# EAGLE design OP LILYGO PT2 (EAGLE 7.1.0)

## Sheet 1 of 2
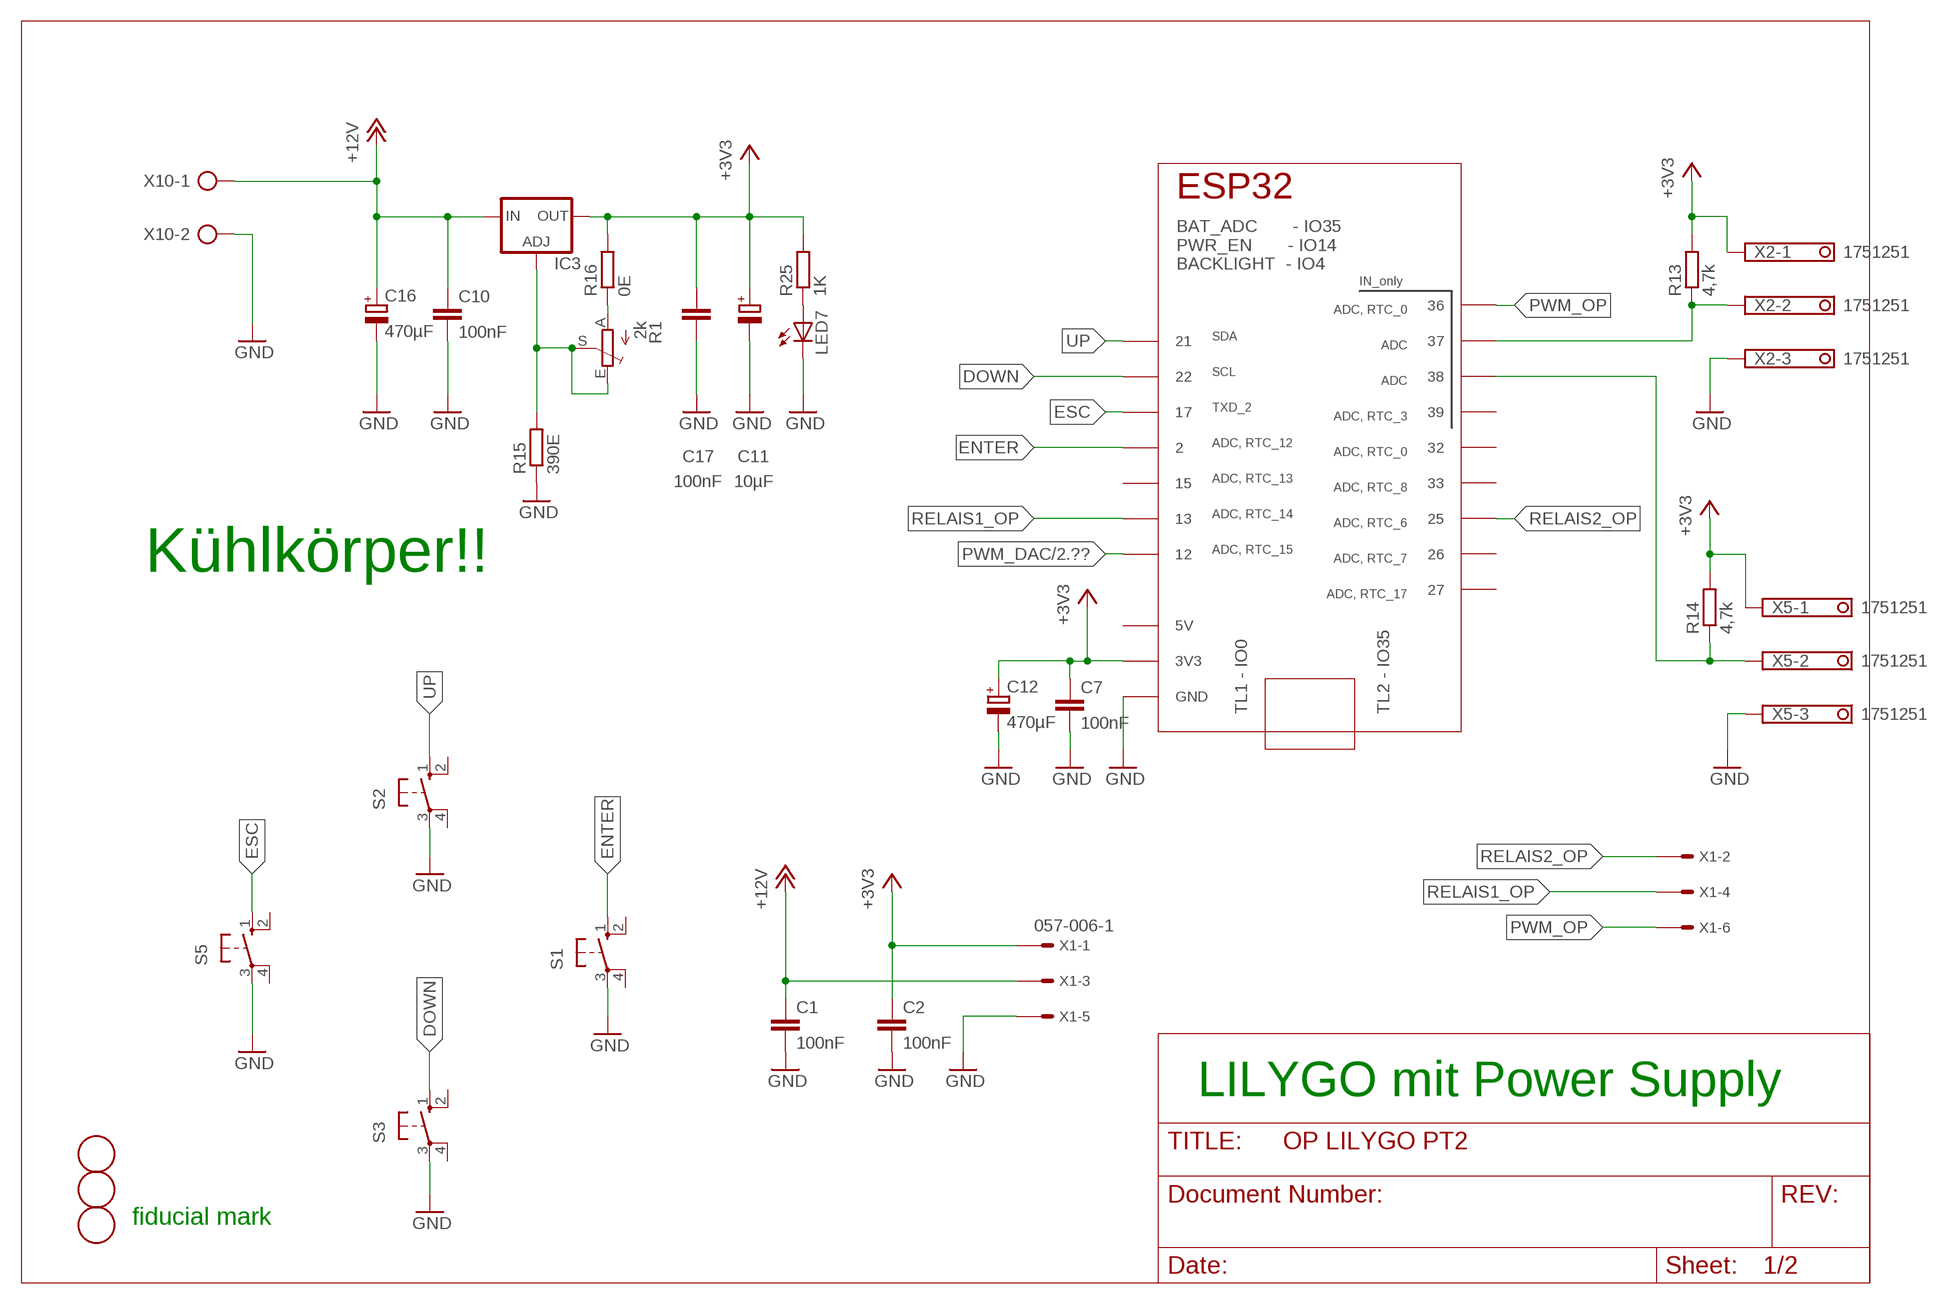
[diagram p0: schematic, sheet 1]

### Parts
C1  100nF  C-EU025-030X050  [C025-030X050]
C2  100nF  C-EU025-030X050  [C025-030X050]
C7  100nF  C-EU025-030X050  [C025-030X050]
C10  100nF  C-EU025-030X050  [C025-030X050]
C11  10µF  CPOL-EUE2.5-6  [E2,5-6]
C12  470µF  CPOL-EUE2.5-6  [E2,5-6]
C16  470µF  CPOL-EUE2.5-6  [E2,5-6]
C17  100nF  C-EU025-030X050  [C025-030X050]
IC3  LM317TS  [317TS]
IC4  TTGO_DISP  [TTGO_DISP_DEFAULT]
LED7  LED5MM  [LED5MM]
R1  2k  TRIM_1234-S64YW  [S64YW]
R13  4,7k  R-EU_0207/12  [0207/12]
R14  4,7k  R-EU_0207/12  [0207/12]
R15  390E  R-EU_0207/12  [0207/12]
R16  0E  R-EU_0207/12  [0207/12]
R25  1K  R-EU_0207/12  [0207/12]
S1  10-XX  [B3F-10XX]
S2  10-XX  [B3F-10XX]
S3  10-XX  [B3F-10XX]
S5  10-XX  [B3F-10XX]
U$2  FIDUCIALMOUNT  [FIDUCIA-MOUNT]
U$7  FIDUCIALMOUNT  [FIDUCIA-MOUNT]
U$8  FIDUCIALMOUNT  [FIDUCIA-MOUNT]
X1  057-006-1  [057-006-1]
X2  1751251  [1751251]
X5  1751251  [1751251]
X10  SMKDSP_1,5/2  [SMKDSP_1,5/2]

### Nets
+3V3: C2.1 C7.1 C11.+ C12.+ C17.1 IC3.2(OUT) IC4.3V3_1(3V3) IC4.3V3_2(3V3) R13.2 R14.2 R16.2 R25.2 X1.1 X2.1 X5.1
+12V: C1.1 C10.1 C16.+ IC3.3(IN) X1.3 X10.1 ; also sheet 2
DOWN: IC4.22 S3.1(S)
ENTER: IC4.2 S1.1(S)
ESC: IC4.17 S5.1(S)
GND: C1.2 C2.2 C7.2 C10.2 C11.- C12.- C16.- C17.2 IC4.GND_1(GND) IC4.GND_2(GND) IC4.GND_3(GND) IC4.GND_4(GND) IC4.GND_5(GND) LED7.K(C) R15.1 S1.3(P) S2.3(P) S3.3(P) S5.3(P) X1.5 X2.3 X5.3 X10.2 ; also sheet 2
N$1: IC3.1(ADJ) R1.E R1.S R15.2
N$2: R1.A R16.1
N$15: IC4.37 R13.1 X2.2
N$19: IC4.38 R14.1 X5.2
N$38: LED7.A R25.1
PWM_DAC: IC4.12 ; also sheet 2
PWM_OP: IC4.36 X1.6
RELAIS1_OP: IC4.13 X1.4
RELAIS2_OP: IC4.25 X1.2
UP: IC4.21 S2.1(S)
Unconnected: IC4.5V IC4.15 IC4.26 IC4.27 IC4.32 IC4.33 IC4.39 R1.S@1(S) S1.2(S1) S1.4(P1) S2.2(S1) S2.4(P1) S3.2(S1) S3.4(P1) S5.2(S1) S5.4(P1)

### Notes on the sheet
- Kühlkörper!!
- LILYGO mit Power Supply
- fiducial mark

## Sheet 2 of 2
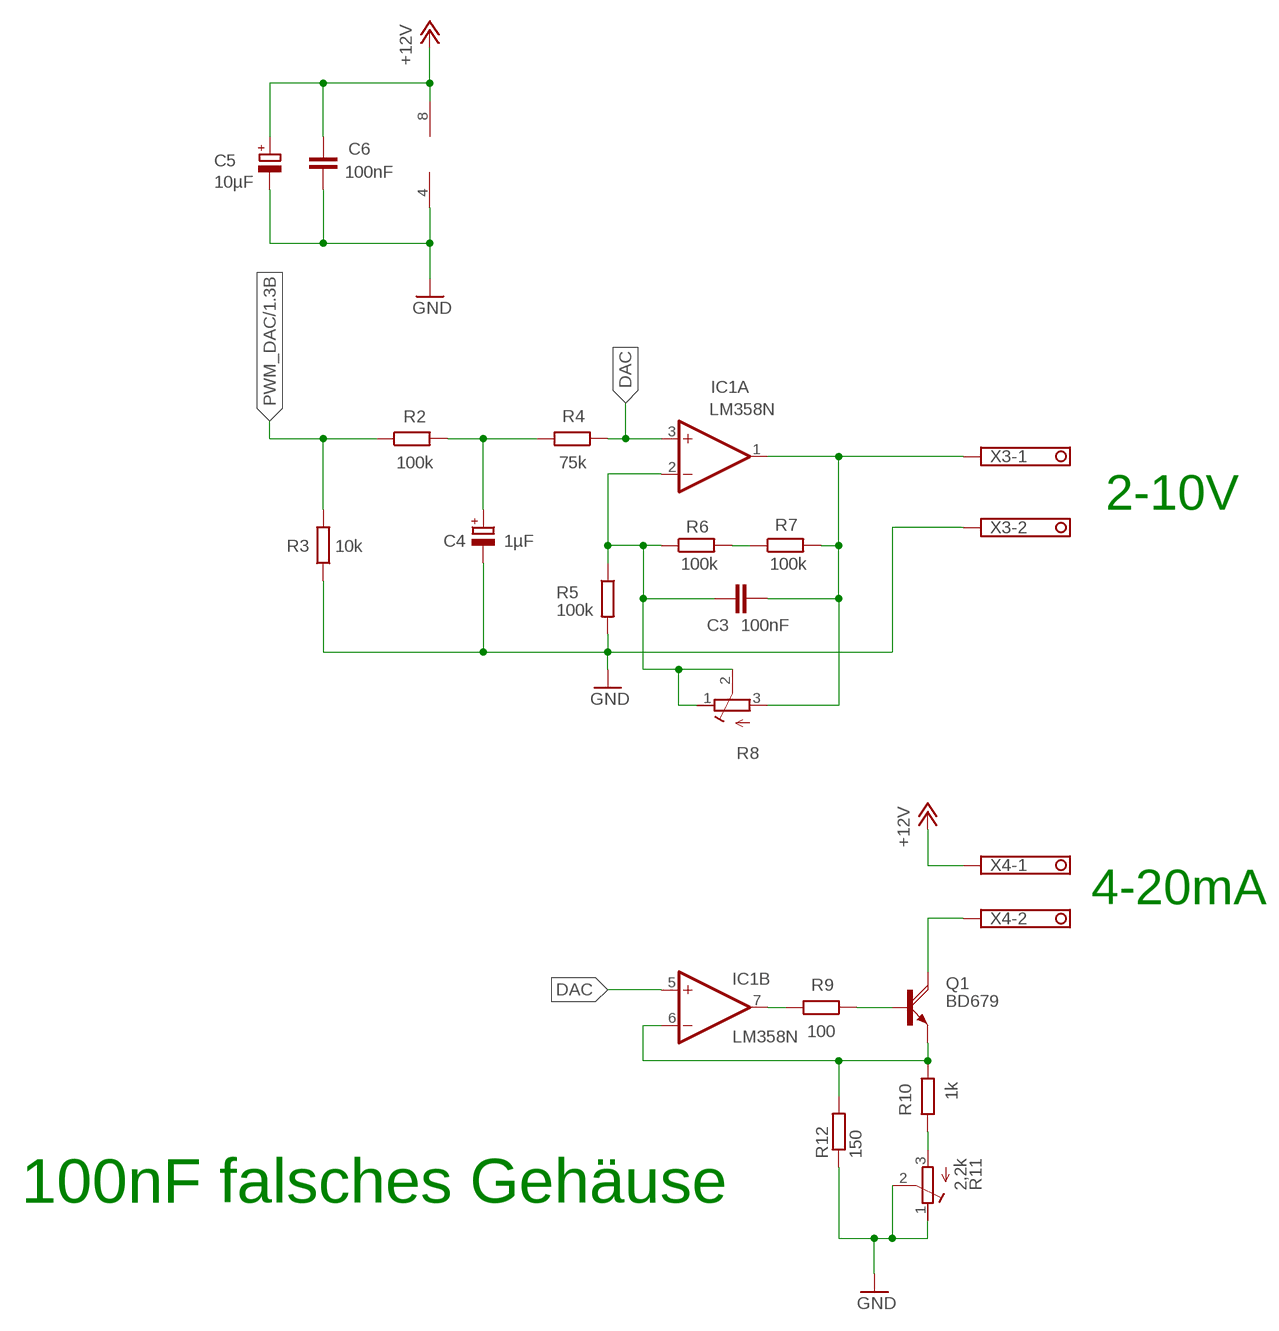
[diagram p1: schematic, sheet 2]

### Parts
C3  100nF  C-EU050-035X075  [C050-035X075]
C4  1µF  CPOL-EUE2.5-5  [E2,5-5]
C5  10µF  CPOL-EUE2.5-5  [E2,5-5]
C6  100nF  C-EU050-035X075  [C050-035X075]
IC1  LM358N  [DIL08]
Q1  BD679  [TO126AV]
R2  100k  R-EU_0207/2V  [0207/2V]
R3  10k  R-EU_0207/2V  [0207/2V]
R4  75k  R-EU_0207/2V  [0207/2V]
R5  100k  R-EU_0207/2V  [0207/2V]
R6  100k  R-EU_0207/2V  [0207/2V]
R7  100k  R-EU_0207/2V  [0207/2V]
R8  R-TRIMMT93YA  [RTRIMT93YA]
R9  100  R-EU_0207/10  [0207/10]
R10  1k  R-EU_0207/2V  [0207/2V]
R11  2,2k  R-TRIMMT93YA  [RTRIMT93YA]
R12  150  R-EU_0207/12  [0207/12]
X3  1751248  [1751248]
X4  1751248  [1751248]

### Nets
+12V: C5.+ C6.1 IC1.8(P:V+) X4.1 ; also sheet 1
DAC: IC1.3(A:+IN) IC1.5(B:+IN) R4.1
GND: C4.- C5.- C6.2 IC1.4(P:V-) R3.1 R5.2 R11.1(E) R11.2(S) R12.1 X3.2 ; also sheet 1
N$12: C3.1 IC1.2(A:-IN) R5.1 R6.1 R8.1(E) R8.2(S)
N$13: C4.+ R2.2 R4.2
N$14: R10.2 R11.3(A)
N$16: C3.2 IC1.1(A:OUT) R7.2 R8.3(A) X3.1
N$17: R6.2 R7.1
N$18: IC1.6(B:-IN) Q1.E R10.1 R12.2
N$20: Q1.B R9.1
N$21: IC1.7(B:OUT) R9.2
N$22: Q1.C X4.2
PWM_DAC: R2.1 R3.2 ; also sheet 1

### Notes on the sheet
- 2-10V
- 4-20mA
- 100nF falsches Gehäuse

## Library data of the parts
C1-C3 C6 C7 C10 C17 = rcl:C-EU: CAPACITOR, European symbol
C4 C5 C11 C12 C16 = rcl:CPOL-EU: POLARIZED CAPACITOR, European symbol
IC1 = linear:LM358: OP AMP also LM158; LM258; LM2904 Source: http://cache.national.com/ds/LM/LM158.pdf
IC3 = v-reg:LM317TS: VOLTAGE REGULATOR
IC4 = TTGO_LCD_DISP:TTGO_DISP; HEIGHT: 11
LED7 = led:LED: LED OSRAM: - CHIPLED LG R971, LG N971, LY N971, LG Q971, LY Q971, LO R971, LY R971 LH N974, LH R974 LS Q976, LO Q976, LY Q976 LO Q996 - Hyper CHIPLED LW Q18S LB Q993, LB Q99A, LB R99A - SideLED LS A670, LO A670, LY A670, LG A670, LP A670 LB A673, LV A673, LT A673, LW A673 LH A674 LY A675 LS A676, LA A676, LO A676, LY A676, LW A676 LS A679, LY A679, LG A679 - Hyper Micro SIDELED® LS Y876, LA Y876, LO Y876, LY Y876 LT Y87S - SmartLED LW L88C, LW L88S LB L89C, LB L89S, LG L890 LS L89K, LO L89K, LY L89K LS L896, LA L896, LO L896, LY L896 - TOPLED LS T670, LO T670, LY T670, LG T670, LP T670 LSG T670, LSP T670, LSY T670, LOP T670, LYG T670 LG T671, LOG T671, LSG T671 LB T673, LV T673, LT T673, LW T673 LH T674 LS T676, LA T676, LO T676, LY T676, LB T676, LH T676, LSB T676, LW T676 LB T67C, LV T67C, LT T67C, LS T67K, LO T67K, LY T67K, LW E67C LS E67B, LA E67B, LO E67B, LY E67B, LB E67C, LV E67C, LT E67C LW T67C LS T679, LY T679, LG T679 LS T770, LO T770, LY T770, LG T770, LP T770 LB T773, LV T773, LT T773, LW T773 LH T774 LS E675, LA E675, LY E675, LS T675 LS T776, LA T776, LO T776, LY T776, LB T776 LHGB T686 LT T68C, LB T68C - Hyper Mini TOPLED® LB M676 - Mini TOPLED Santana® LG M470 LS M47K, LO M47K, LY M47K Source: http://www.osram.convergy.de LUXEON: - LUMILED® LXK2-PW12-R00, LXK2-PW12-S00, LXK2-PW14-U00, LXK2-PW14-V00 LXK2-PM12-R00, LXK2-PM12-S00, LXK2-PM14-U00 LXK2-PE12-Q00, LXK2-PE12-R00, LXK2-PE12-S00, LXK2-PE14-T00, LXK2-PE14-U00 LXK2-PB12-K00, LXK2-PB12-L00, LXK2-PB12-M00, LXK2-PB14-N00, LXK2-PB14-P00, LXK2-PB14-Q00 LXK2-PR12-L00, LXK2-PR12-M00, LXK2-PR14-Q00, LXK2-PR14-R00 LXK2-PD12-Q00, LXK2-PD12-R00, LXK2-PD12-S00 LXK2-PH12-R00, LXK2-PH12-S00 LXK2-PL12-P00, LXK2-PL12-Q00, LXK2-PL12-R00 Source: www.luxeon.com KINGBRIGHT: KA-3528ASYC Source: www.kingbright.com
Q1 = transistor-power:BD679: NPN DARLINGTON TRANSISTOR
R1 = pot:TRIM_1234-: POTENTIOMETER
R2-R7 R9 R10 R12-R16 R25 = rcl:R-EU_: RESISTOR, European symbol
R8 R11 = rcl:R-TRIMM: Trimm resistor
S1-S3 S5 = switch-omron:10-XX: OMRON SWITCH; MPN: B3F-1000; OC_FARNELL: 176432; OC_NEWARK: 36M3542
U$2 U$7 U$8 = SmartPrj:FIDUCIALMOUNT
X1 = con-panduit:057-006-: CONNECTOR 6-pin series 057 contact pc board low profile headers; OC_FARNELL: unknown; OC_NEWARK: unknown
X2 X5 = con-phoenix-350:1751251: MKDS 1/ 3-3,5 Printklemme Nennstrom: 10 A Bemessungsspannung: 160 V Raster: 3,5 mm Polzahl: 3 Montageart: Löten Anschlussart: Schraubanschluss Anschlussrichtung vom Leiter zur Platine: 0° Source: http://eshop.phoenixcontact.com .. 1751251.pdf; OC_FARNELL: unknown; OC_NEWARK: unknown
X3 X4 = con-phoenix-350:1751248: MKDS 1/ 2-3,5 Printklemme Nennstrom: 10 A Bemessungsspannung: 160 V Raster: 3,5 mm Polzahl: 2 Montageart: Löten Anschlussart: Schraubanschluss Anschlussrichtung vom Leiter zur Platine: 0° Source: http://eshop.phoenixcontact.com .. 1751248.pdf; OC_FARNELL: unknown; OC_NEWARK: unknown
X10 = con-phoenix-smkdsp:SMKDSP_1,5/2: Printklemme, Nennstrom: 17,5 A, Bemessungsspannung: 250 V, Raster: 5,0 mm Source: http://eshop.phoenixcontact.de .. 1733415.pdf; MF: FARNELL; MPN: 1733570; OC_FARNELL: 3041244; OC_NEWARK: 69C8588

## Board
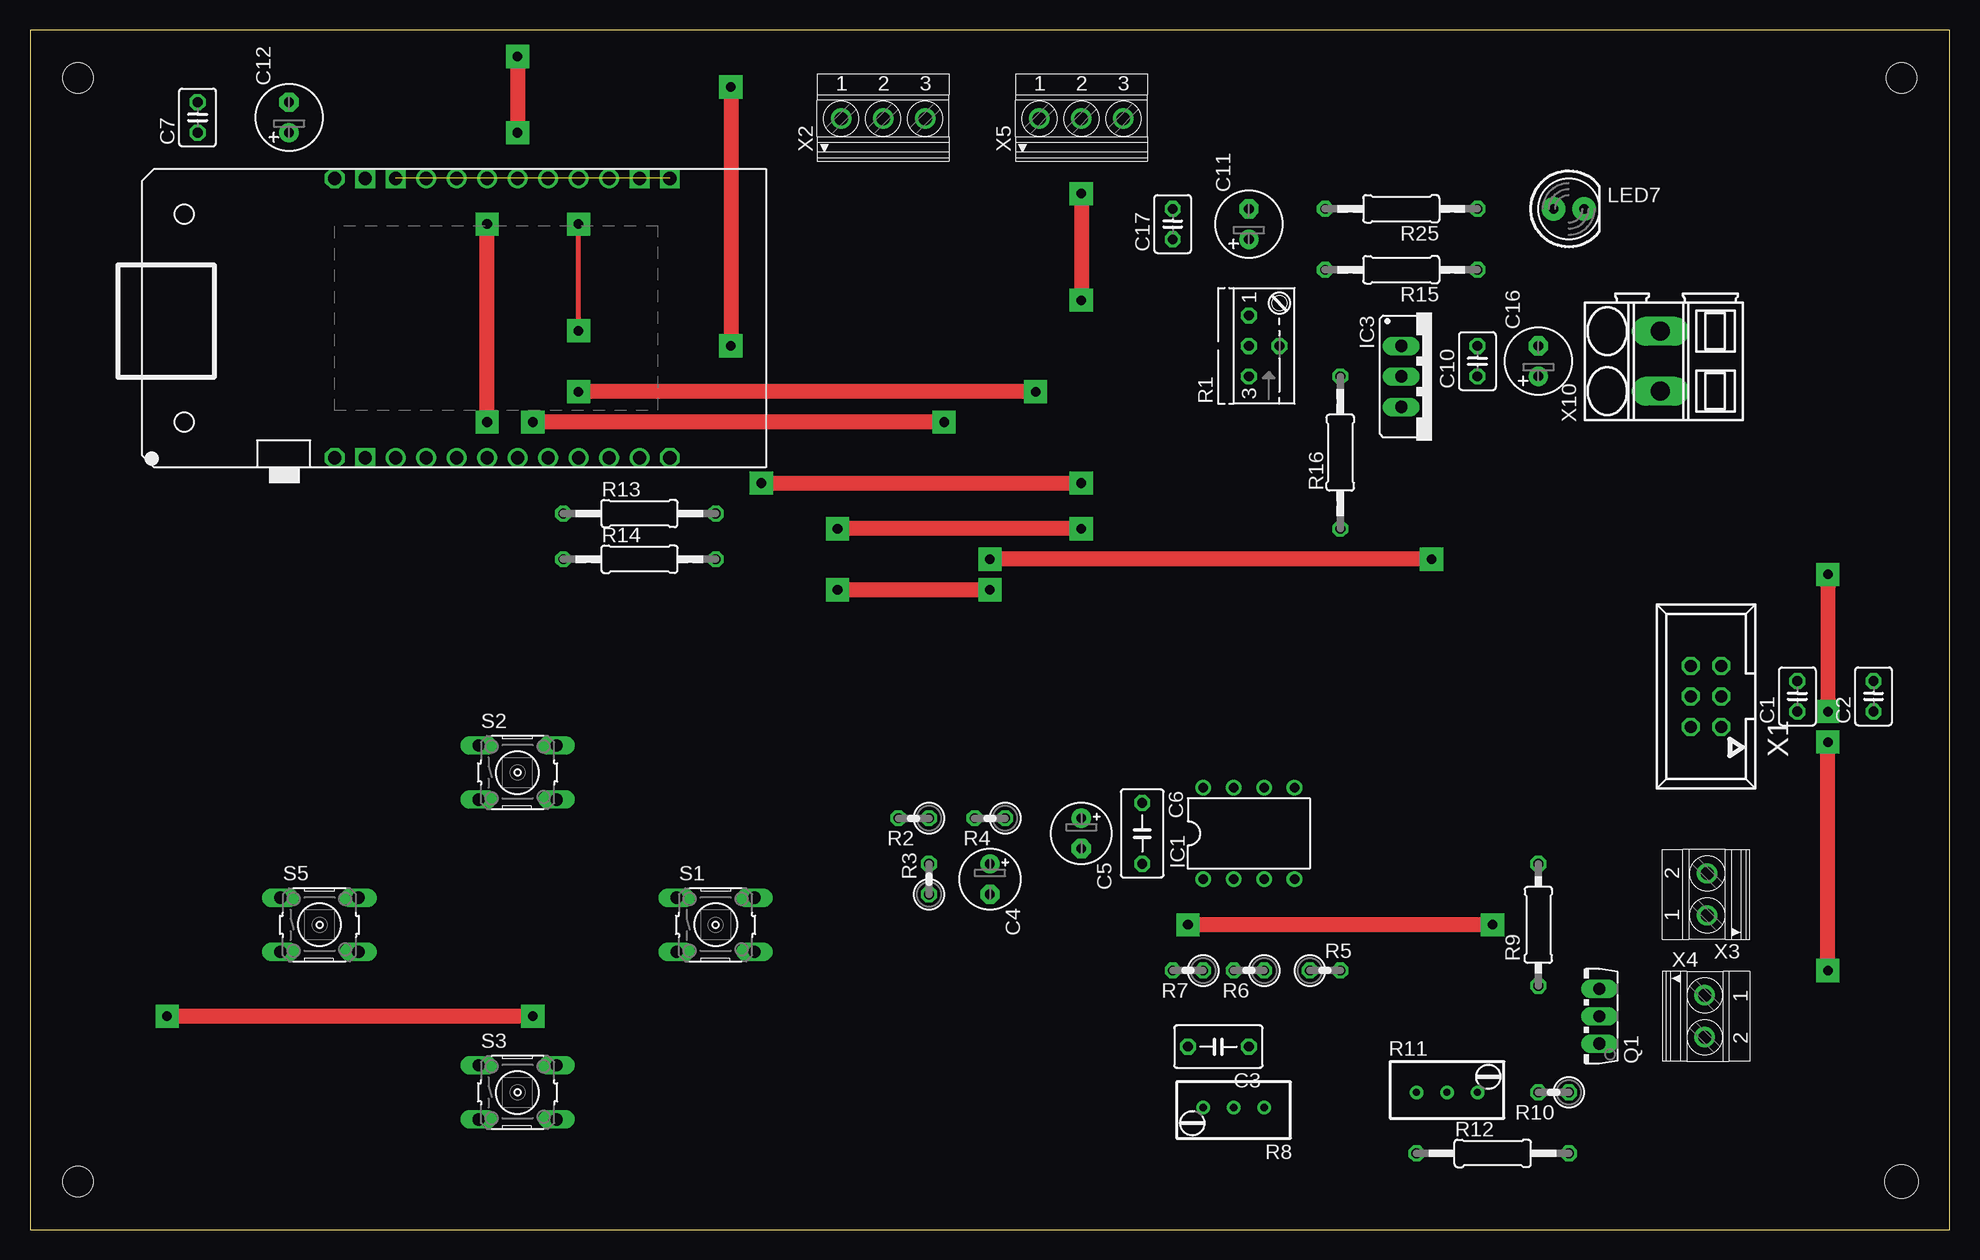
[diagram p2: board, top side]
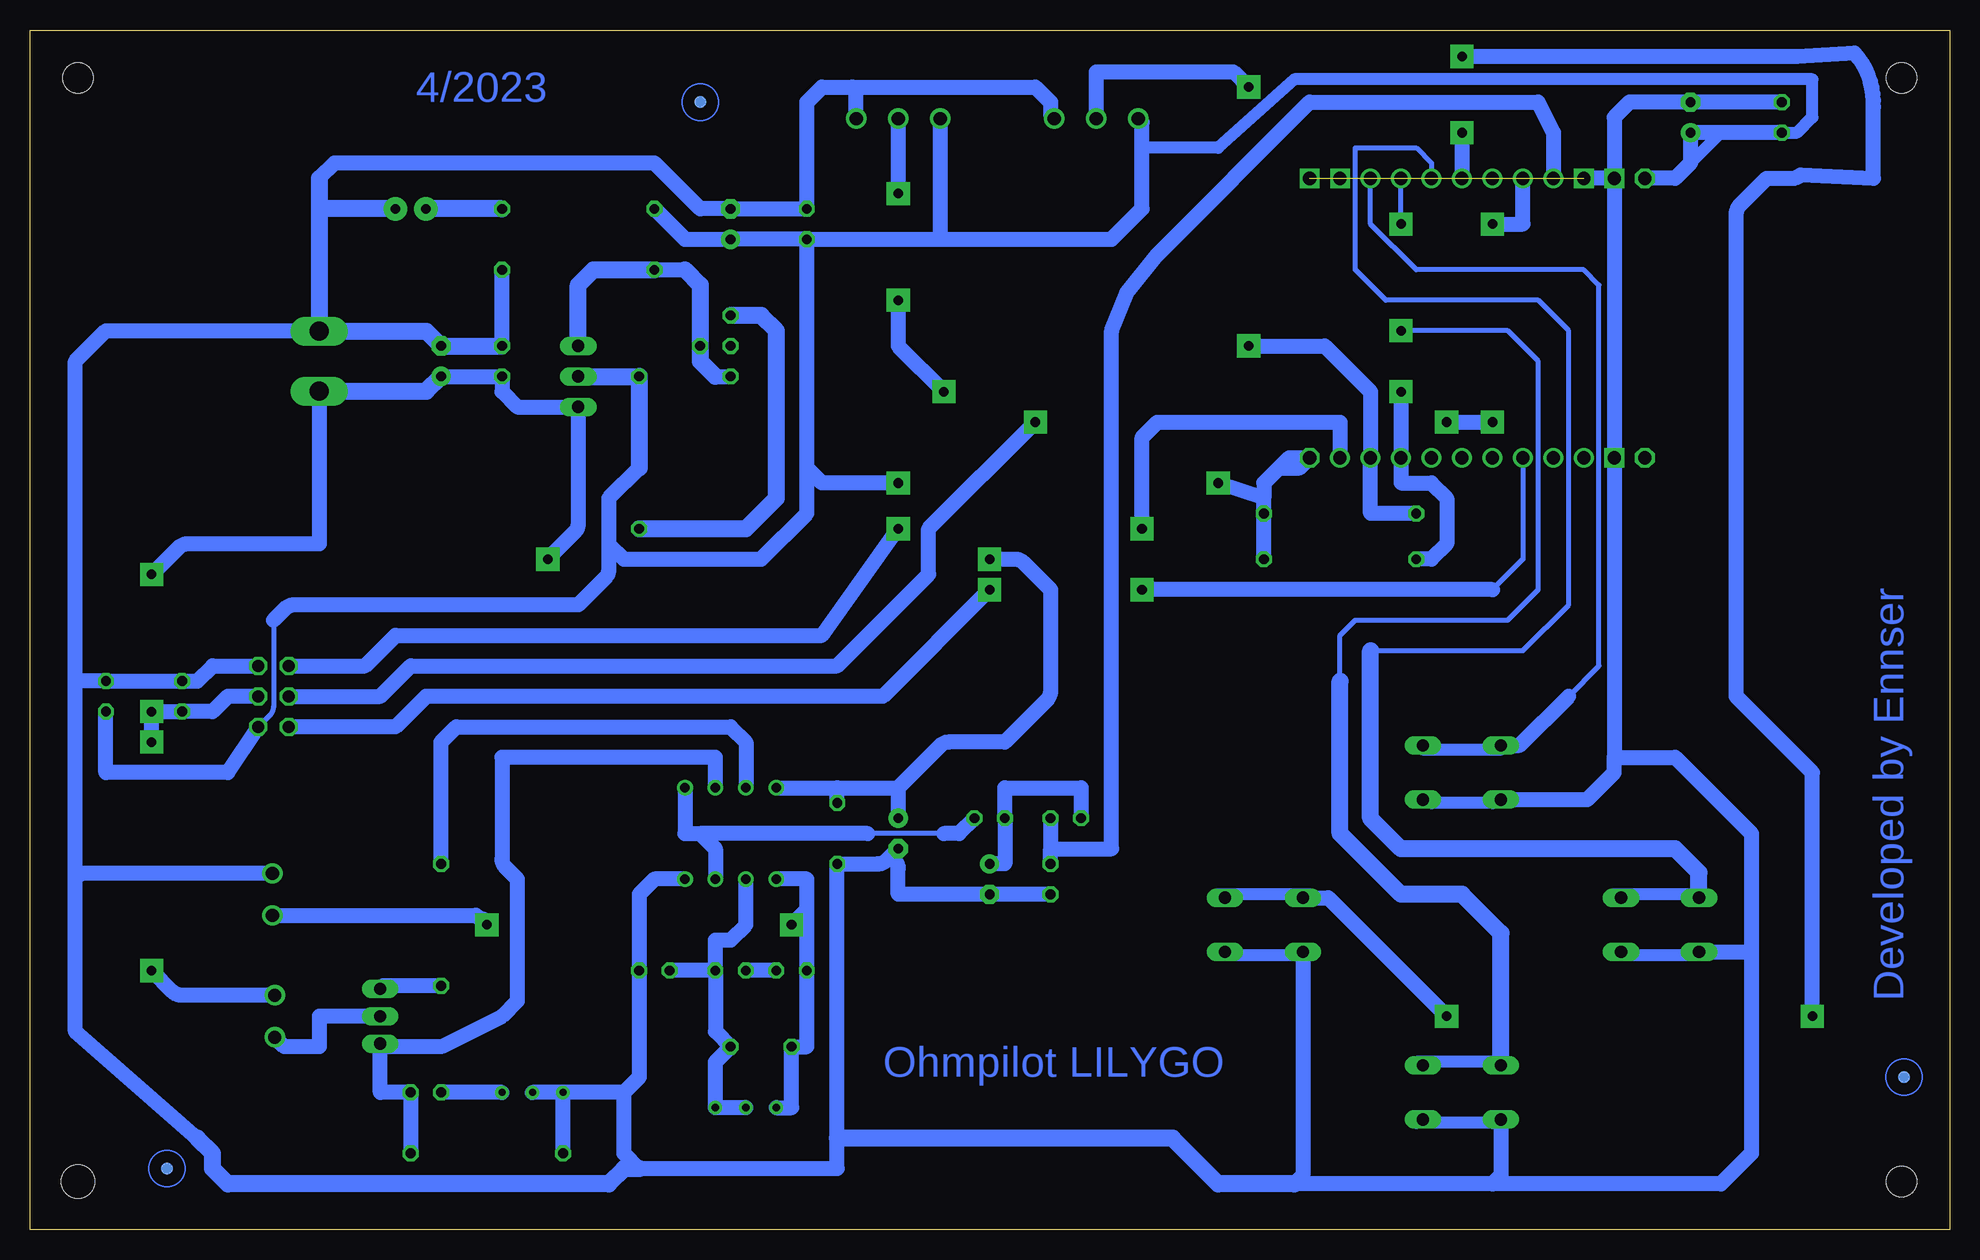
[diagram p3: board, bottom side, seen from below]

Size 160 x 100 mm. Coordinates in mm from the lower left corner, seen from the top.
Outline: 0,0 160,0 160,100 0,100 0,0
Copper layers (1*16): Top 0.035mm / dielectric 1.5mm / Bottom 0.035mm
Design rules "default": minimum track width 10mil, minimum drill 24mil, track to track 8mil, track to pad 8mil, pad to pad 8mil, via to via 8mil, smd to smd 8mil, copper to edge 40mil, drill to drill 8mil, minimum pad ring 10mil, minimum via ring 8mil, stop-mask expansion 4mil, vias tented up to drill 0mil, thermal gap 10mil
Holes 2.5 mm at 4,4 4,96 156,96
Holes 2.8 mm at 156,4

### Footprints (pad centres in the part's own frame; a part is rotated, then mirrored left to right if it is on the bottom)
C025-030X050 = drill 0.813 octagon: 1 -1.27,0; 2 1.27,0
C050-035X075 = drill 0.813 octagon: 1 -2.54,0; 2 2.54,0
E2,5-5 = drill 0.813 pad 1.6: + -1.27,0 | drill 0.813 pad 1.6 octagon: - 1.27,0
E2,5-6 = drill 0.813 pad 1.6: + -1.27,0 | drill 0.813 pad 1.6 octagon: - 1.27,0
DIL08 = drill 0.813 pad 1.27: 1 -3.81,-3.81; 2 -1.27,-3.81; 3 1.27,-3.81; 4 3.81,-3.81; 5 3.81,3.81; 6 1.27,3.81; 7 -1.27,3.81; 8 -3.81,3.81
317TS = drill 1.016 long: 1 -2.54,-2.54; 2 0,-2.54; 3 2.54,-2.54
TTGO_DISP_DEFAULT = drill 1.1: 2 12.7,0; 12 20.32,0; 13 17.78,0; 15 15.24,0; 17 10.16,0; 21 5.08,0; 22 7.62,0; 25 17.78,23.3; 26 20.32,23.3; 27 22.86,23.3; 32 12.7,23.3; 33 15.24,23.3; 36 2.54,23.3; 37 5.08,23.3; 38 7.62,23.3; 39 10.16,23.3 | drill 1.1 octagon: 3V3_1 0,23.3; 3V3_2 27.94,0; 5V 27.94,23.3 | drill 1.1 square: GND_1 0,0; GND_2 2.54,0; GND_3 22.86,0; GND_4 25.4,0; GND_5 25.4,23.3
LED5MM = drill 0.813 pad 1.93: A -1.27,0; K 1.27,0
TO126AV = drill 1.016 long: B 2.286,-1.27; C 0,-1.27; E -2.286,-1.27
S64YW = drill 0.813 octagon: A 2.54,1.27; E -2.54,1.27; S 0,-1.27; S@1 0,1.27
0207/2V = drill 0.813 octagon: 1 -1.27,0; 2 1.27,0
RTRIMT93YA = drill 0.61: 1 0,-2.54; 2 0,0; 3 0,2.54
0207/10 = drill 0.813 octagon: 1 -5.08,0; 2 5.08,0
0207/12 = drill 0.813 octagon: 1 -6.35,0; 2 6.35,0
B3F-10XX = drill 1.016 long: 1 -3.251,2.261; 2 3.251,2.261; 3 -3.251,-2.261; 4 3.251,-2.261
FIDUCIA-MOUNT = smd 1.016 x 1.016: P$1 0,0
057-006-1 = drill 1 octagon: 1 -2.54,-1.27; 2 -2.54,1.27; 3 0,-1.27; 4 0,1.27; 5 2.54,-1.27; 6 2.54,1.27
1751251 = drill 1.1 pad 1.7: 1 -3.5,-0.1; 2 0,-0.1; 3 3.5,-0.1
1751248 = drill 1.1 pad 1.7: 1 -1.75,-0.1; 2 1.75,-0.1
SMKDSP_1,5/2 = drill 1.6 pad 1.8 long: 1 -2.5,0; 2 2.5,0

### Placement (x,y rotation side)
C1  147.32,44.45 90 top
C2  153.67,44.45 90 top
C3  99.06,15.24 180 top
C4  80.01,29.21 270 top
C5  87.63,33.02 270 top
C6  92.71,33.02 270 top
C7  13.97,92.71 90 top
C10  120.65,72.39 90 top
C11  101.6,83.82 90 top
C12  21.59,92.71 90 top
C16  125.73,72.39 90 top
C17  95.25,83.82 90 top
IC1  101.6,33.02 0 top
IC3  116.84,71.12 270 top
IC4  53.34,87.63 180 top
LED7  128.27,85.09 0 top
Q1  129.54,17.78 90 top
R1  102.87,73.66 90 top
R2  73.66,34.29 180 top
R3  74.93,29.21 90 top
R4  80.01,34.29 180 top
R5  107.95,21.59 0 top
R6  101.6,21.59 180 top
R7  96.52,21.59 180 top
R8  100.33,10.16 90 top
R9  125.73,25.4 90 top
R10  127,11.43 180 top
R11  118.11,11.43 270 top
R12  121.92,6.35 0 top
R13  50.8,59.69 0 top
R14  50.8,55.88 0 top
R15  114.3,80.01 180 top
R16  109.22,64.77 90 top
R25  114.3,85.09 180 top
S1  57.15,25.4 0 top
S2  40.64,38.1 0 top
S3  40.64,11.43 0 top
S5  24.13,25.4 0 top
U$2  3.81,12.7 0 bottom
U$7  148.59,5.08 0 bottom
U$8  104.14,93.98 0 bottom
X1  139.7,44.45 90 top
X2  71.12,92.71 0 top
X3  139.7,27.94 90 top
X4  139.7,17.78 270 top
X5  87.63,92.71 0 top
X10  135.89,72.39 90 top

### Tracks (layer width: path | path; a pad name or v marks a point on that pad's centre or on a via)
+3V3  (via drill 0.8 pad 1.93)
  Top 1.27: v60.96,62.23 v87.63,62.23
  Bottom 0.406: 139.7,50.8 139.7,43.59 arc45 139.99,42.89 X1.1
  Bottom 1.016: 22.86,87.63 19.05,91.44 12.7,91.44 11.43,92.71 11.43,95.89 54.61,95.89 60.96,90.17 67.31,90.17
  Bottom 1.27: 109.22,63.5 111.76,60.96 111.76,57.15 | 111.76,57.15 110.49,55.88 99.06,55.88 95.25,59.69 95.25,63.5 | 95.25,63.5 C17.1 | C17.1 C11.+ 105.41,82.55 R25.2 | X1.1 143.51,38.1 153.67,38.1 C2.1 | C17.1 83.82,82.55 | 83.82,82.55 69.85,82.55 67.31,85.09 67.31,90.17 67.31,92.3 X2.1 | X5.1 84.13,82.86 83.82,82.55 | C7.1 19.05,91.44 C12.+ 21.59,88.9 22.86,87.63 IC4.3V3_2 | R14.2 R13.2 57.15,60.96 | 55.88,63.5 57.15,62.23 57.15,60.96 | 55.88,63.5 54.17,63.5 IC4.3V3_1 55.05,64.33 55.88,63.5 | 57.15,60.96 v60.96,62.23 | v87.63,62.23 93.98,62.23 95.25,63.5 | 111.76,57.15 111.76,55.02 arc45 112.05,54.32 114.3,52.07 138.02,52.07 arc-45 138.72,51.78 139.7,50.8
  Bottom 1.422: IC3.2 R16.2 109.22,63.5
+12V  (via drill 0.8 pad 1.93)
  Top 1.27: v149.86,54.61 v149.86,43.18 | v149.86,21.59 v149.86,40.64 | v116.84,55.88 v80.01,55.88
  Bottom 1.27: C16.+ C10.1 120.65,69.85 119.38,68.58 IC3.3 114.3,58.83 arc45 114.59,58.13 v116.84,55.88 | X1.3 143.51,44.45 144.78,43.18 C1.1 v149.86,43.18 v149.86,40.64 | X10.1 135.89,57.15 146.91,57.15 arc-45 147.61,56.86 v149.86,54.61 | X4.1 147.39,19.53 arc45 148.09,19.82 v149.86,21.59 | IC1.8 92.71,36.83 | 92.71,36.83 87.63,36.83 | 87.63,36.83 C5.+ | C6.1 92.71,36.83 | v80.01,55.88 77.88,55.88 arc45 77.18,55.59 74.93,53.34 74.93,44.86 arc45 75.22,44.16 78.74,40.64 83.41,40.64 arc-45 84.11,40.35 87.63,36.83
  Bottom 1.422: X10.1 126.96,69.89 C16.+
DAC
  Bottom 0.406: 83.82,33.02 90.17,33.02
  Bottom 1.27: IC1.5 105.41,33.02 104.14,33.02 | 104.14,33.02 102.87,31.75 IC1.3 | 90.17,33.02 104.14,33.02 | R4.1 82.55,33.02 83.82,33.02
DOWN  (via drill 0.8 pad 1.93)
  Top 0.406: v45.72,74.93 v45.72,83.82
  Bottom 0.406: 50.8,45.72 50.8,49.53 49.53,50.8 36.83,50.8 34.29,53.34 34.29,72.39 36.83,74.93 v45.72,74.93 | v45.72,83.82 IC4.22
  Bottom 1.422: S3.1 37.39,24.69 40.64,27.94 45.72,27.94 50.8,33.02 50.8,45.72
ENTER  (via drill 0.8 pad 1.93)
  Top 1.27: v41.91,17.78 v11.43,17.78 | v40.64,97.79 v40.64,91.44
  Bottom 1.27: S1.1 51.79,27.66 v41.91,17.78 | v11.43,17.78 11.43,38.1 17.78,44.45 17.78,84.68 arc45 17.49,85.38 15.24,87.63 13.11,87.63 arc-45 12.41,87.92 6.35,87.63 6.35,93.57 arc-45 7.91,98.08 12.7,97.79 v40.64,97.79 | v40.64,91.44 IC4.2
ESC
  Bottom 0.406: 48.26,48.26 35.56,48.26 31.75,52.07 31.75,74.93 34.29,77.47 46.99,77.47 49.53,80.01 49.53,90.17 44.45,90.17 43.18,88.9 IC4.17
  Bottom 1.016: S5.1 20.32,27.66
  Bottom 1.422: S5.1 20.88,29.77 22.86,31.75 45.72,31.75 48.26,34.29 48.26,48.26
GND  (2 unrouted)
  Bottom 1.016: 135.89,74.93 X10.2
  Bottom 1.27: C10.2 R15.1 | 135.89,87.63 134.62,88.9 107.95,88.9 104.14,85.09 C11.- C17.2 95.25,93.98 93.98,95.25 91.44,95.25 | R3.1 C4.- 87.63,27.94 87.63,30.07 arc-45 87.92,30.77 88.27,31.11 | R12.1 R11.1 | R11.1 R11.2 | IC1.4 107.95,29.21 109.22,27.94 R5.2 109.22,12.7 110.49,11.43 | 110.49,11.43 R11.1 | 110.49,11.43 110.49,6.35 109.22,5.08 92.71,5.08 92.71,7.62 C6.2 89.31,30.48 arc-45 88.61,30.77 88.27,31.11 | IC4.GND_4 IC4.GND_5 27.94,39.37 | 27.94,39.37 22.86,39.37 16.51,33.02 16.51,22.86 | 16.51,22.86 16.51,6.35 19.05,3.81 38.1,3.81 | 38.1,3.81 54.61,3.81 53.9,4.52 S1.3 | 146.05,7.62 156.21,16.51 156.21,29.21 | 156.21,29.21 156.21,45.72 | 156.21,45.72 156.21,72.39 153.67,74.93 135.93,74.93 X10.2 | X3.2 155.73,29.69 156.21,29.21 | 156.21,45.72 C2.2 C1.2 146.05,45.72 144.78,46.99 X1.5 | 91.44,95.25 76.2,95.25 74.93,93.98 74.93,92.92 X2.3 | X5.3 91.13,94.94 91.44,95.25 | S2.3 30.2,35.84 27.94,38.1 27.94,39.37 | S3.3 37.39,4.52 38.1,3.81 | S5.3 16.79,23.14 16.51,22.86 | C7.2 C12.- 26.67,93.98 27.94,92.71 IC4.GND_4 | IC4.GND_4 IC4.GND_3 | 88.27,31.11 C5.-
  Bottom 1.422: LED7.K 135.89,85.09 | 135.89,85.09 X10.2 126.96,74.89 C16.- C10.2 | 135.89,87.63 135.89,85.09 | 54.61,3.81 60.96,3.81 64.77,7.62 92.71,7.62 | 109.22,5.08 110.49,5.08 111.76,3.81 143.51,3.81 144.78,5.08 144.78,6.35 146.05,7.62
N$1
  Bottom 1.27: R15.2 105.41,80.01 | 102.87,71.12 R1.E
  Bottom 1.422: IC3.1 114.3,78.74 113.03,80.01 R15.2 | 105.41,80.01 104.14,78.74 R1.S 104.14,72.39 102.87,71.12
N$2
  Bottom 1.422: R16.1 100.33,58.42 97.79,60.96 97.79,74.93 99.06,76.2 R1.A
N$3
  Bottom 1.016: 43.81,40.01 37.47,40.01
N$4
  Bottom 1.016: 38.1,35.56 43.18,35.56
N$5
  Bottom 1.016: 20.32,27.94 27.94,27.94
N$6
  Bottom 1.016: 21.59,22.86 26.67,22.86
N$7
  Bottom 1.016: 53.34,27.94 60.96,27.94
N$8
  Bottom 1.016: 54.61,22.86 59.69,22.86
N$9
  Bottom 1.016: 38.1,13.97 44.45,13.97
N$10
  Bottom 1.016: 38.1,8.89 44.45,8.89
N$12
  Bottom 1.27: R8.2 R8.1 102.87,13.97 C3.1 102.87,16.51 R6.1 | R6.1 R5.1 | R6.1 102.87,24.13 101.6,24.13 100.33,25.4 IC1.2
N$13
  Bottom 1.27: C4.+ 78.74,30.48 R4.2 78.74,36.83 72.39,36.83 R2.2
N$14
  Bottom 1.27: R11.3 R10.2
N$15  (via drill 0.8 pad 1.93)
  Top 1.27: v58.42,95.25 v58.42,73.66
  Bottom 1.27: X2.2 71.12,96.52 59.69,96.52 v58.42,95.25 | v58.42,73.66 52.07,73.66 48.26,69.85 IC4.37 48.26,59.69 R13.1
N$16  (via drill 0.8 pad 1.93)
  Top 1.27: v121.92,25.4 v96.52,25.4
  Bottom 1.27: R8.3 96.52,10.16 C3.2 95.25,15.24 R7.2 95.25,26.67 | 95.25,26.67 95.25,29.21 IC1.1 | X3.1 122.81,26.19 arc-45 122.11,25.85 v121.92,25.4 | v96.52,25.4 95.25,26.67
N$17
  Bottom 1.27: R7.1 R6.2
N$18
  Bottom 1.27: R12.2 R10.1 130.81,11.43 Q1.E 130.56,15.24 125.73,15.24 120.65,17.78 119.38,19.05 119.38,29.21 120.36,30.19 arc45 120.65,30.89 120.65,39.37 102.87,39.37 IC1.6
N$19  (via drill 0.8 pad 1.93)
  Top 1.27: v87.63,86.36 v87.63,77.47 | v83.82,69.85 v45.72,69.85
  Bottom 1.27: R14.1 43.18,55.88 41.91,57.15 41.91,60.96 43.18,62.23 45.72,62.23 IC4.38 v45.72,69.85 | X5.2 v87.63,86.36 | v87.63,77.47 87.63,73.66 v83.82,69.85
N$20
  Bottom 1.27: R9.1 130.56,20.32 Q1.B
N$21
  Bottom 1.27: R9.2 125.73,40.64 124.46,41.91 101.6,41.91 100.33,40.64 IC1.7
N$22
  Bottom 1.27: Q1.C 135.89,17.78 135.89,15.24 138.81,15.24 X4.2
N$38
  Bottom 1.422: R25.1 LED7.A
PWM_DAC
  Bottom 1.27: R3.2 74.93,31.75 | R2.1 74.93,31.75 | 74.93,31.75 69.85,31.75 69.85,74.93 68.58,78.11 66.04,81.28 53.34,93.98 34.29,93.98 33.02,91.44 IC4.12
PWM_OP  (via drill 0.8 pad 1.93)
  Top 1.27: v87.63,58.42 v67.31,58.42
  Bottom 1.27: X1.6 132.08,46.99 129.54,49.53 93.98,49.53 v87.63,58.42 | v67.31,58.42 67.31,66.04 66.04,67.31 50.8,67.31 IC4.36
RELAIS1_OP  (via drill 0.8 pad 1.93)
  Top 1.27: v76.2,67.31 v41.91,67.31 | v38.1,67.31 v38.1,83.82
  Bottom 1.27: X1.4 130.81,44.45 128.27,46.99 92.71,46.99 85.09,54.61 85.09,58.42 v76.2,67.31 | v41.91,67.31 v38.1,67.31 | v38.1,83.82 35.56,83.82 IC4.13
RELAIS2_OP  (via drill 0.8 pad 1.93)
  Top 1.27: v67.31,53.34 v80.01,53.34
  Bottom 0.406: IC4.25 35.56,55.88 38.1,53.34
  Bottom 1.27: 38.1,53.34 v67.31,53.34 | v80.01,53.34 88.9,44.45 127,44.45 129.54,41.91 X1.2
UP
  Bottom 0.406: 31.75,44.45 29.21,46.99 29.21,78.74 30.48,80.01 44.45,80.01 48.26,83.82 IC4.21
  Bottom 0.61: S2.1 36.83,40.36
  Bottom 1.27: S2.1 35.84,40.36 31.75,44.45

### Text on the board
Bottom: 4/2023 | Developed by Ennser | Ohmpilot LILYGO